# Altium project canDrive_hw_board2_v2.PrjPcb
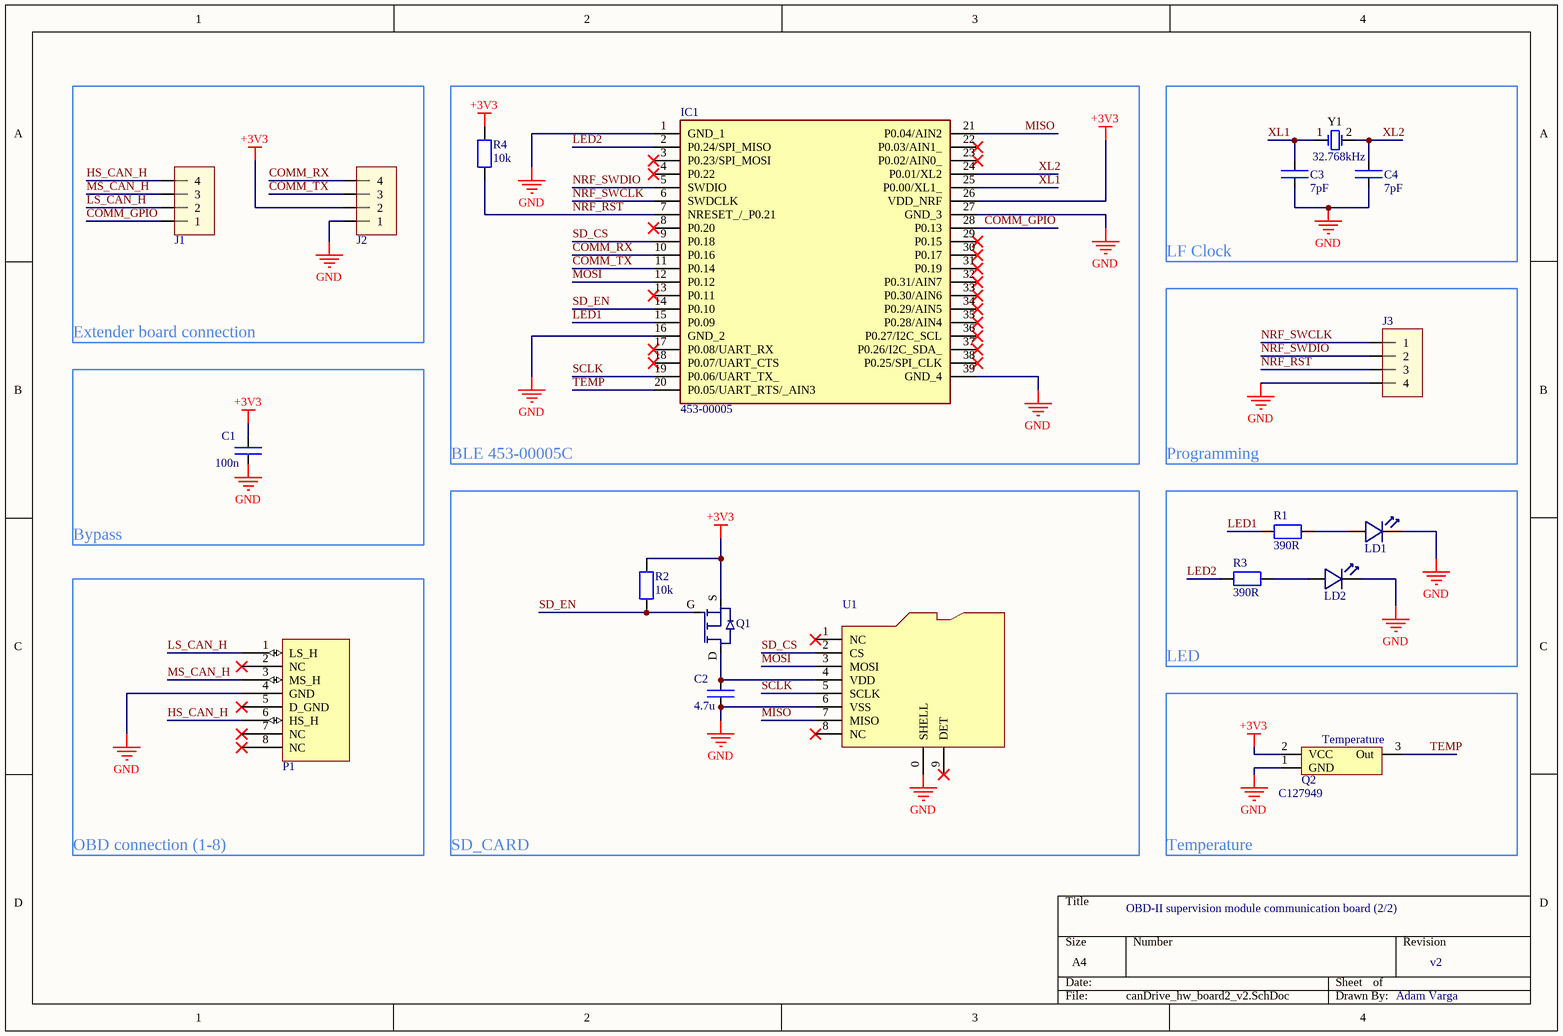
[diagram p0: canDrive_hw_board2_v2.SchDoc]
1 sheet, 19 parts. Net scope: global (net labels, ports and power ports of the same name join across sheets).
Board file: canDrive_hw_board2_v2.PcbDoc

## Sheet canDrive_hw_board2_v2.SchDoc
size A4

### Parts
C1  value 100n  [C0603]  (hidden comment: Capacitor)
C2  value 4.7u  [C0603]  (hidden comment: Capacitor)
C3  value 7pF  [C0603]  (hidden comment: Capacitor)
C4  value 7pF  [C0603]  (hidden comment: Capacitor)
IC1  453-00005  [45300005]
J1  CON_1x4  [127mm_header_4pin]  (value not drawn)
J2  CON_1x4  [127mm_header_4pin]  (value not drawn)
J3  CON_1x4  [ribbon4pin]  (value not drawn)
LD1  LED  [LED_0603]  (value not drawn)
LD2  LED  [LED_0603]  (value not drawn)
P1  OBD_connector1-8  [OBD1-8]  (value not drawn)
Q1  MOFFET_pCH  [SOT-23]  (value not drawn)
Q2  Part: C127949  [SOT-23]  (hidden comment: Temp_sensor)
R1  value 390R  [R0603]  (hidden comment: Resistor)
R2  value 10k  [R0603]  (hidden comment: Resistor)
R3  value 390R  [R0603]  (hidden comment: Resistor)
R4  value 10k  [R0603]  (hidden comment: Resistor)
U1  MicroSD Molex 105162-0001  [MICRO_USB_BIG]  (value not drawn)
Y1  value 32.768kHz  [TXC-9HT10_V]  (hidden comment: 9HT10-32.768KDZF-T)

### Blocks framed on the sheet
Extender board connection: J1 J2
BLE 453-00005C: IC1 R4
LF Clock: C3 C4 Y1
Programming: J3
Bypass: C1
SD_CARD: C2 Q1 R2 U1
LED: LD1 LD2 R1 R3
OBD connection (1-8): P1
Temperature: Q2

### Nets
+3V3: C1.1 IC1.26(VDD_NRF) J2.2 Q1.S Q2.2(VCC) R2.1 R4.1
GND: C1.0 C2.0 C3.0 C4.0 IC1.1(GND_1) IC1.16(GND_2) IC1.27(GND_3) IC1.39(GND_4) J2.1 J3.4 LD1.C LD2.C P1.4(GND) Q2.1(GND) U1.0(SHELL) U1.6(VSS)
COMM_GPIO: IC1.28(P0.13) J1.1
COMM_RX: IC1.10(P0.16) J2.4
COMM_TX: IC1.11(P0.14) J2.3
HS_CAN_H: J1.4 P1.6(HS_H)
LED1: IC1.15(P0.09) R1.1
LED2: IC1.2(P0.24/SPI_MISO) R3.1
LS_CAN_H: J1.2 P1.1(LS_H)
MISO: IC1.21(P0.04/AIN2) U1.7(MISO)
MOSI: IC1.12(P0.12) U1.3(MOSI)
MS_CAN_H: J1.3 P1.3(MS_H)
NRF_RST: IC1.7(NRESET_/_P0.21) J3.3 R4.0
NRF_SWCLK: IC1.6(SWDCLK) J3.1
NRF_SWDIO: IC1.5(SWDIO) J3.2
SCLK: IC1.19(P0.06/UART_TX_) U1.5(SCLK)
SD_CS: IC1.9(P0.18) U1.2(CS)
SD_EN: IC1.14(P0.10) Q1.G R2.0
TEMP: IC1.20(P0.05/UART_RTS/_AIN3) Q2.3(Out)
XL1: C3.1 IC1.25(P0.00/XL1_) Y1.1
XL2: C4.1 IC1.24(P0.01/XL2) Y1.2
NetC2_1: C2.1 Q1.D U1.4(VDD)
NetLD1_A: LD1.A R1.0
NetLD2_A: LD2.A R3.0

Not connected (* = marked no-connect by the designer): IC1 3(P0.23/SPI_MOSI)* 4(P0.22)* 8(P0.20)* 13(P0.11)* 17(P0.08/UART_RX)* 18(P0.07/UART_CTS)* 22(P0.03/AIN1_)* 23(P0.02/AIN0_)* 29(P0.15)* 30(P0.17)* 31(P0.19)* 32(P0.31/AIN7)* 33(P0.30/AIN6)* 34(P0.29/AIN5)* 35(P0.28/AIN4)* 36(P0.27/I2C_SCL)* 37(P0.26/I2C_SDA_)* 38(P0.25/SPI_CLK)*; P1 2(NC)* 5(D_GND)* 7(NC)* 8(NC)*; U1 1(NC)* 8(NC)* 9(DET)*

### Notes on the sheet
- OBD-II supervision module communication board (2/2)
- v2
- Adam Varga
- (in symbol Temp_sensor) Temperature

### Library data of the parts
C3 C4 = Capacitor: Part: C326971; Link: https://lcsc.com/product-detail/Others_YAGEO-CC0603CRNPO9BN7R0_C326971.html
IC1 = 453-00005: Integrated Circuit; Manufacturer_Part_Number: 453-00005; Link: https://hu.farnell.com/laird/453-00005c/bl651-series-bt-v5-module-int/dp/3020333?ost=453-00005&krypto=XEH%2FBc%2FeTXjIC2a51Vh11lidcTJJnb79NFdZTNY7vel11Y1jMILKBTFekt9cSJLY8%2Bn7V83OFvnQPhLI4ot5mMcDxLoG1RThIK7NyM7HqqY%3D&ddkey=https%3Ahu-HU%2FElement14_Hungary%2Fsearch
J1-J3 = CON_1x4: 1x4 connector; Type: DF57H-4P-1.2V Hirose HDR Lighting Connector
P1 = OBD1-8
Q1 = MOFFET_pCH: MOSFET P_CH; pin to pad: D>1 G>2 S>3; Part: C130884; Link: https://lcsc.com/product-detail/MOSFET_SK-DMP3098L_C130884.html
Q2 = Temp_sensor: Temperature sensor; Link: https://lcsc.com/product-detail/Temperature-Sensors_Microchip-Tech-MCP9700AT-E-TT_C127949.html
U1 = MicroSD Molex 105162-0001: Part: C266612; Link: https://lcsc.com/product-detail/Card-Sockets-Connectors_XUNPU-TF-104_C266612.html
Y1 = 9HT10-32.768KDZF-T: Tuning Fork, 32.768 KHz, -40 to 85 degC, 2-Pin SMD, RoHS, Tape and Reel; Part: C280830; Name: Nihon Dempa Kogyo EXS00A-MU00202; Link: https://lcsc.com/product-detail/_Nihon-Dempa-Kogyo-EXS00A-MU00202_C280830.html; Price: $0.1212
C1 C2 = Capacitor
  C2: Link: https://lcsc.com/product-detail/Multilayer-Ceramic-Capacitors-MLCC-SMD-SMT_SAMSUNG_CL10A475KO8NNNC_4-7uF-475-10-16V_C19666.html
LD1 LD2 = LED: Link: https://lcsc.com/product-detail/Light-Emitting-Diodes-LED_Orient-ORH-B36G_C193191.html
R1-R4 = Resistor
  R2 R4: Link: https://lcsc.com/product-detail/Chip-Resistor-Surface-Mount_10KR-103-5_C99198.html